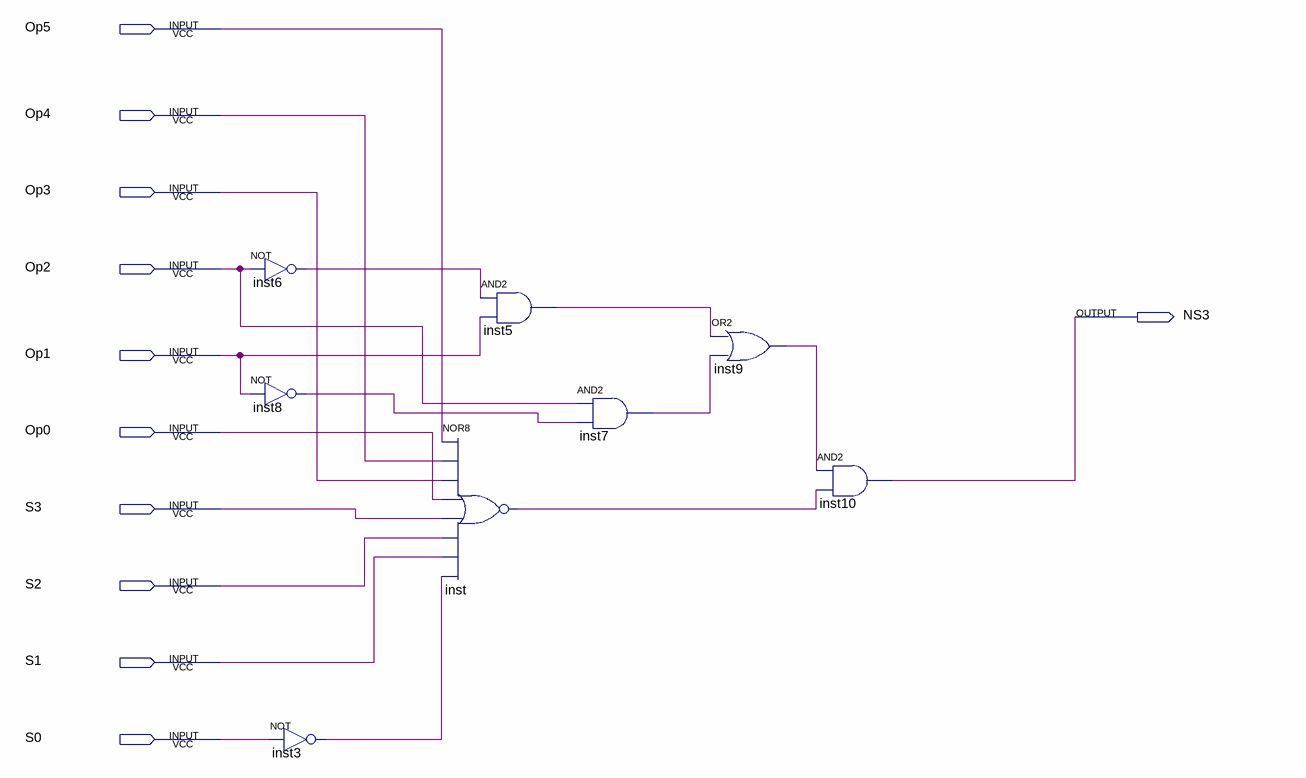
[diagram p0: schematic sheet]
// Quartus schematic NS3.bdf as structural Verilog: 8 symbols, 11 pins
module NS3 (
  input  Op5,
  input  Op4,
  input  Op3,
  input  Op2,
  input  Op1,
  input  Op0,
  input  S3,
  input  S2,
  input  S1,
  input  S0,
  output NS3
);

  wire inst3_out, inst5_out, inst6_out, inst7_out, inst8_out, inst9_out, inst_out;

  not inst6 (inst6_out, Op2);
  not inst8 (inst8_out, Op1);
  not inst3 (inst3_out, S0);
  nor inst (inst_out, Op5, Op4, Op3, Op0, S3, S2, S1, inst3_out);
  and inst5 (inst5_out, inst6_out, Op1);
  and inst7 (inst7_out, Op2, inst8_out);
  or inst9 (inst9_out, inst5_out, inst7_out);
  and inst10 (NS3, inst9_out, inst_out);
endmodule
